# EAGLE design DisplayBoad (EAGLE 6.4)
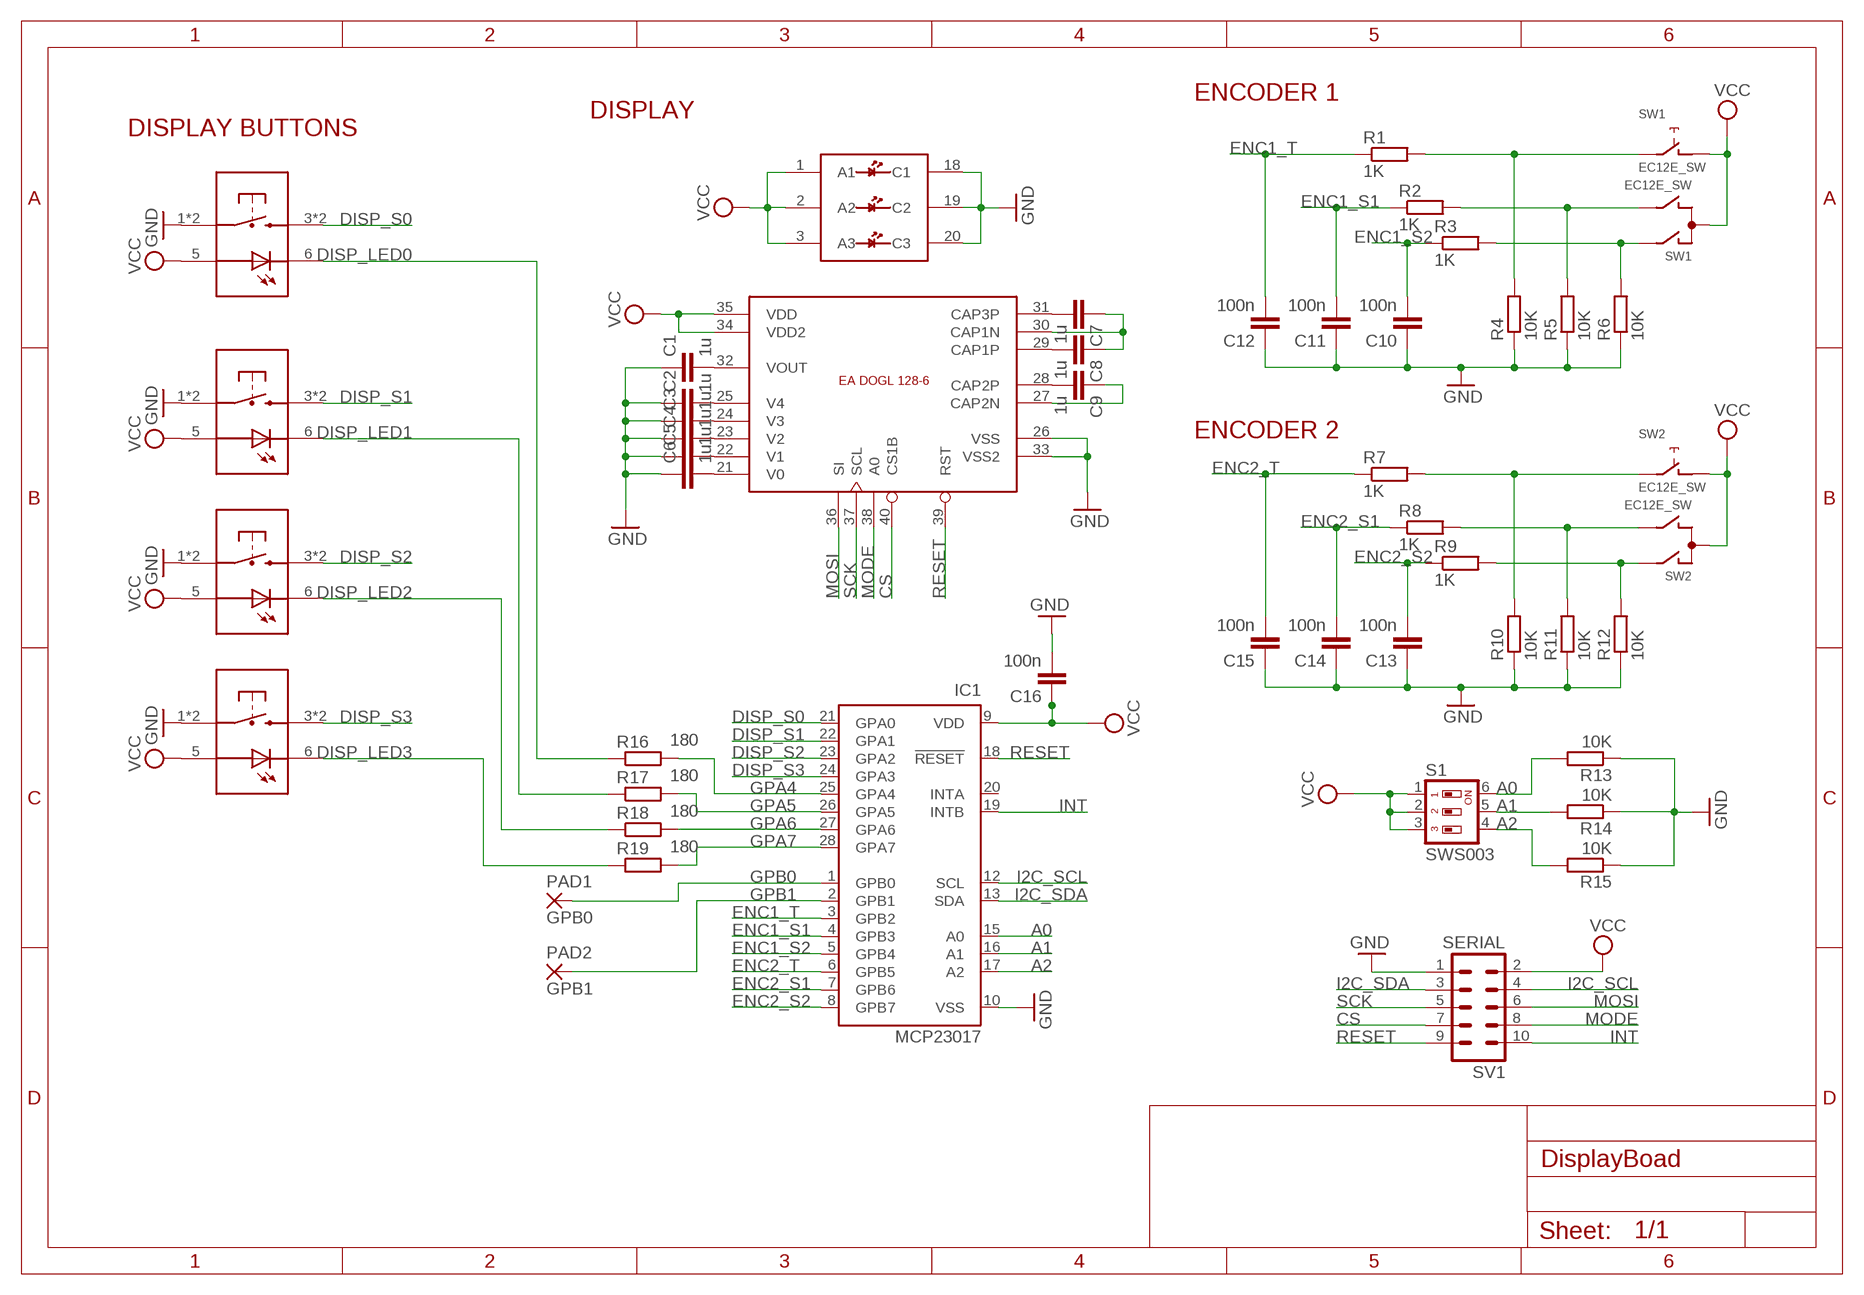
[diagram p0: schematic, sheet 1]

## Parts
C1  1u  C-EUC0805  [C0805]
C2  1u  C-EUC0805  [C0805]
C3  1u  C-EUC0805  [C0805]
C4  1u  C-EUC0805  [C0805]
C5  1u  C-EUC0805  [C0805]
C6  1u  C-EUC0805  [C0805]
C7  1u  C-EUC0805  [C0805]
C8  1u  C-EUC0805  [C0805]
C9  1u  C-EUC0805  [C0805]
C10  100n  C-EUC0603  [C0603]
C11  100n  C-EUC0603  [C0603]
C12  100n  C-EUC0603  [C0603]
C13  100n  C-EUC0603  [C0603]
C14  100n  C-EUC0603  [C0603]
C15  100n  C-EUC0603  [C0603]
C16  100n  C-EUC0603  [C0603]
IC1  MCP23017  MCP23017SS  [SSOP28]
PAD1  GPB0  2,15/1,0  [2,15/1,0]
PAD2  GPB1  2,15/1,0  [2,15/1,0]
R1  1K  R-EU_R0603  [R0603]
R2  1K  R-EU_R0603  [R0603]
R3  1K  R-EU_R0603  [R0603]
R4  10K  R-EU_R0603  [R0603]
R5  10K  R-EU_R0603  [R0603]
R6  10K  R-EU_R0603  [R0603]
R7  1K  R-EU_R0603  [R0603]
R8  1K  R-EU_R0603  [R0603]
R9  1K  R-EU_R0603  [R0603]
R10  10K  R-EU_R0603  [R0603]
R11  10K  R-EU_R0603  [R0603]
R12  10K  R-EU_R0603  [R0603]
R13  10K  R-EU_R0603  [R0603]
R14  10K  R-EU_R0603  [R0603]
R15  10K  R-EU_R0603  [R0603]
R16  180  R-EU_R0603  [R0603]
R17  180  R-EU_R0603  [R0603]
R18  180  R-EU_R0603  [R0603]
R19  180  R-EU_R0603  [R0603]
S1  SWS003  [SMS-003]
SV1  SERIAL  MA05-2  [MA05-2]
SW1  EC12E_SW  [ALPS_EC12E_SW]
SW2  EC12E_SW  [ALPS_EC12E_SW]
U1  EADOGL128-62  [EA_DOGL128-6]
U$2  LP15  [LP15]
U$3  LP15  [LP15]
U$4  LP15  [LP15]
U$5  LP15  [LP15]

## Nets
A0: IC1.15(A0) R13.2 S1.6
A1: IC1.16(A1) R14.2 S1.5
A2: IC1.17(A2) R15.2 S1.4
CS: SV1.7 U1.40(CS1B)
DISP_LED0: R16.1 U$2.6
DISP_LED1: R17.1 U$3.6
DISP_LED2: R18.1 U$4.6
DISP_LED3: R19.1 U$5.6
DISP_S0: IC1.21(GPA0) U$2.3 U$2.4
DISP_S1: IC1.22(GPA1) U$3.3 U$3.4
DISP_S2: IC1.23(GPA2) U$4.3 U$4.4
DISP_S3: IC1.24(GPA3) U$5.3 U$5.4
ENC1_S1: C11.2 IC1.4(GPB3) R2.1
ENC1_S2: C10.2 IC1.5(GPB4) R3.1
ENC1_T: C12.2 IC1.3(GPB2) R1.1
ENC2_S1: C14.2 IC1.7(GPB6) R8.1
ENC2_S2: C13.2 IC1.8(GPB7) R9.1
ENC2_T: C15.2 IC1.6(GPB5) R7.1
GND: C1.1 C2.1 C3.1 C4.1 C5.1 C6.1 C10.1 C11.1 C12.1 C13.1 C14.1 C15.1 C16.2 IC1.10(VSS) R4.1 R5.1 R6.1 R10.1 R11.1 R12.1 R13.1 R14.1 R15.1 SV1.1 U1.18(C1) U1.19(C2) U1.20(C3) U1.26(VSS) U1.33(VSS2) U$2.1 U$2.2 U$3.1 U$3.2 U$4.1 U$4.2 U$5.1 U$5.2
GPA4: IC1.25(GPA4) R16.2
GPA5: IC1.26(GPA5) R17.2
GPA6: IC1.27(GPA6) R18.2
GPA7: IC1.28(GPA7) R19.2
GPB0: IC1.1(GPB0) PAD1.1(P)
GPB1: IC1.2(GPB1) PAD2.1(P)
I2C_SCL: IC1.12(SCL) SV1.4
I2C_SDA: IC1.13(SDA) SV1.3
INT: IC1.19(INTB) SV1.10
MODE: SV1.8 U1.38(A0)
MOSI: SV1.6 U1.36(SI)
N$1: C1.2 U1.32(VOUT)
N$2: C2.2 U1.25(V4)
N$3: C3.2 U1.24(V3)
N$4: C4.2 U1.23(V2)
N$5: C5.2 U1.22(V1)
N$6: C6.2 U1.21(V0)
N$7: C7.2 U1.31(CAP3P)
N$8: C8.2 U1.29(CAP1P)
N$9: C9.2 U1.28(CAP2P)
N$10: C9.1 U1.27(CAP2N)
N$11: C7.1 C8.1 U1.30(CAP1N)
N$12: R7.2 R10.2 SW2.E
N$13: R8.2 R11.2 SW2.B
N$14: R9.2 R12.2 SW2.A
N$15: R1.2 R4.2 SW1.E
N$16: R2.2 R5.2 SW1.B
N$17: R3.2 R6.2 SW1.A
RESET: IC1.18(!RESET) SV1.9 U1.39(RST)
SCK: SV1.5 U1.37(SCL)
VCC: C16.1 IC1.9(VDD) S1.1 S1.2 S1.3 SV1.2 SW1.C SW1.D SW2.C SW2.D U1.1(A1) U1.2(A2) U1.3(A3) U1.34(VDD2) U1.35(VDD) U$2.5 U$3.5 U$4.5 U$5.5
Unconnected: IC1.20(INTA) SW1.GND1(G) SW1.GND2(G) SW2.GND1(G) SW2.GND2(G)

## Notes on the sheet
- ENCODER 1
- DISPLAY
- DISPLAY BUTTONS
- ENCODER 2

## Library data of the parts
C1-C16 = resistor:C-EU: CAPACITOR, European symbol
IC1 = microchip:MCP23017: http://ww1.microchip.com/downloads/en/DeviceDoc/21952a.pdf Source: http://ww1.microchip.com/downloads/en/DeviceDoc/21952a.pdf; MF: MICROCHIP; MPN: MCP23017-E/SS; OC_FARNELL: 1467674; OC_NEWARK: 31K2960
PAD1 PAD2 = wirepad:2,15/1,0: THROUGH-HOLE PAD
R1-R19 = resistor:R-EU_: RESISTOR, European symbol
S1 = smd-special:SWS003: SMD Dip Switch 3 pol.
SV1 = con-lstb:MA05-2: PIN HEADER; OC_FARNELL: unknown; OC_NEWARK: unknown
SW1 SW2 = switch-alps:EC12E_SW: ALPS rotary Encoder EC12E series with switch; MPN: EC12E2424407; OC_FARNELL: 1520813; OC_NEWARK: 74M1068
U1 = ea:EADOGL128-6
U$2-U$5 = SKAARHOJ:LP15

## Board
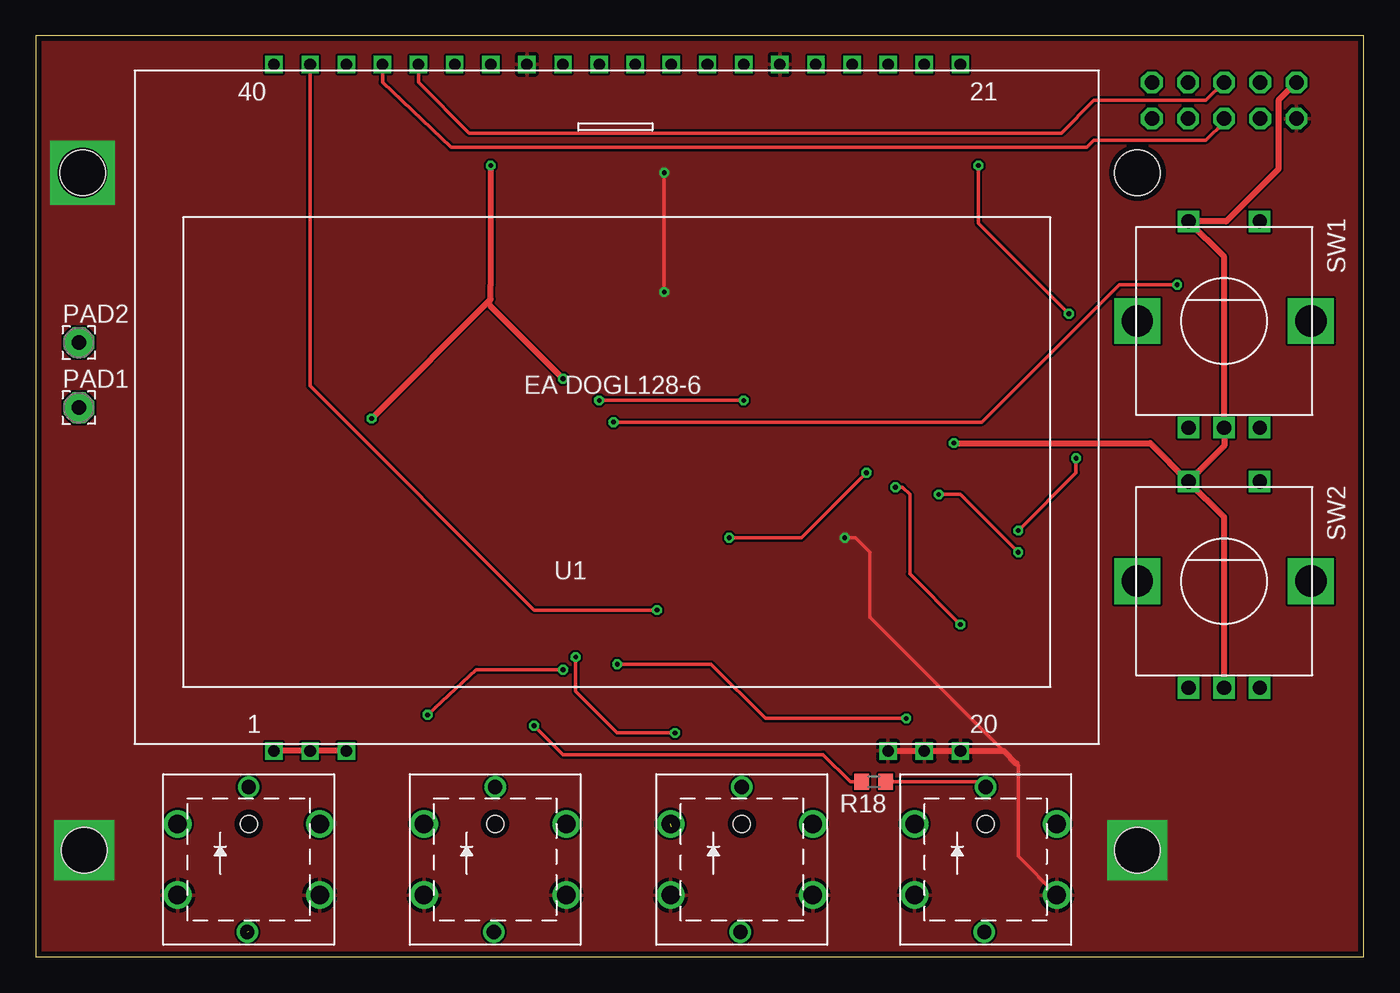
[diagram p1: board, top side]
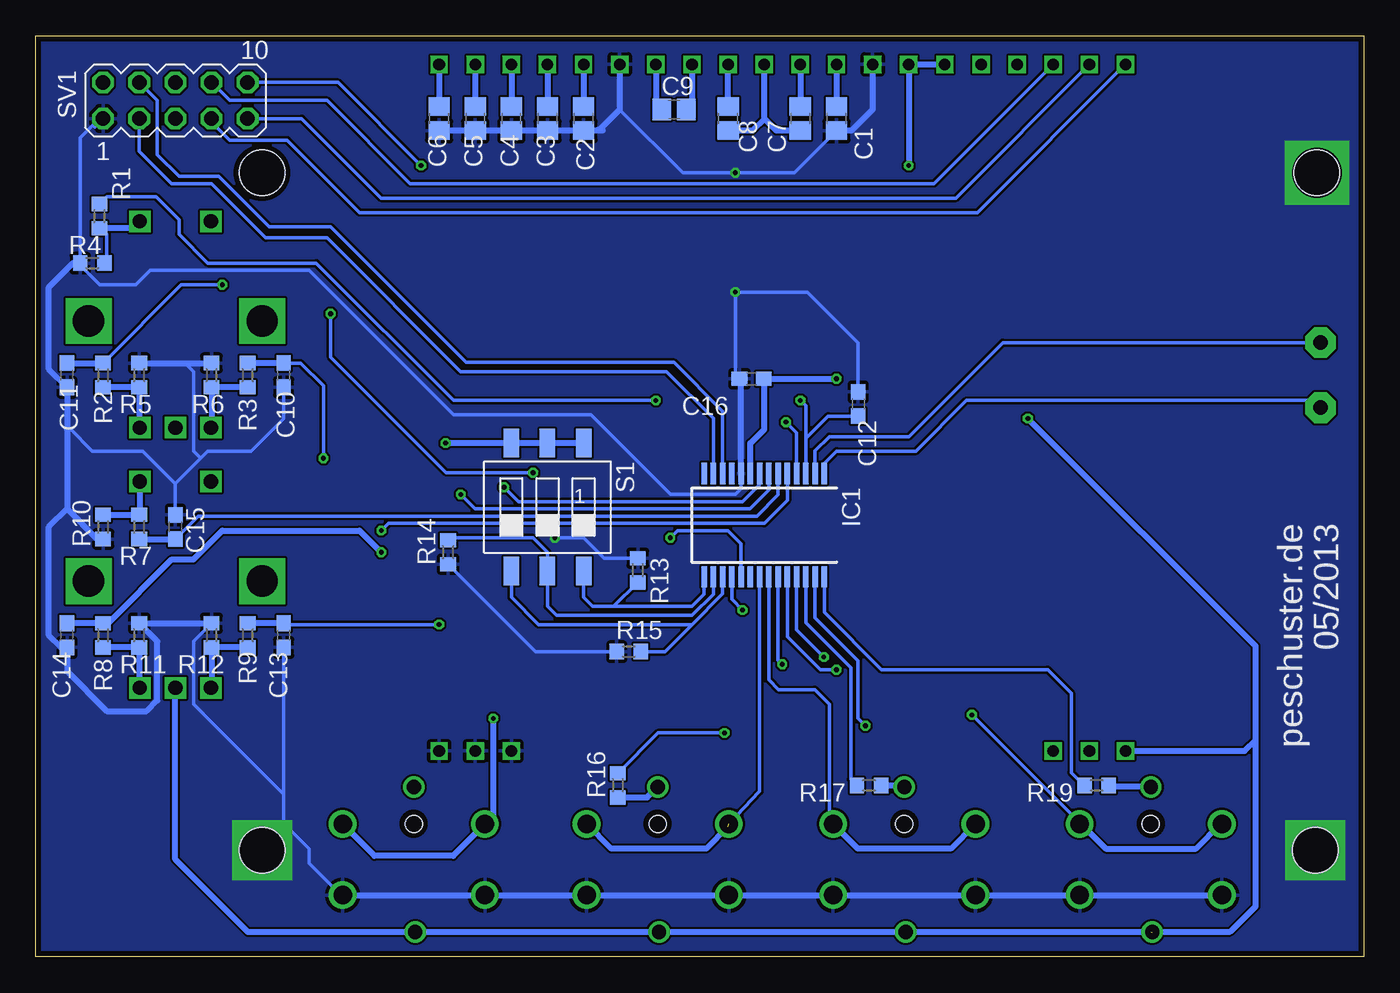
[diagram p2: board, bottom side, seen from below]

Size 93.4 x 64.76 mm. Coordinates in mm from the lower left corner, seen from the top.
Outline: 0,0 93.4,0 93.4,64.76 0,64.76 0,0
Copper layers (1*16): Top 0.0356mm / dielectric 1.5011mm / Bottom 0.0356mm
Design rules "OshPark_PCBOrder": minimum track width 6mil, minimum drill 13mil, track to track 6mil, track to pad 6mil, pad to pad 6mil, via to via 6mil, smd to smd 6mil, copper to edge 15mil, drill to drill 6mil, minimum pad ring 7mil, minimum via ring 7mil, stop-mask expansion 4mil, vias tented up to drill 0mil, thermal gap 10mil
Holes 3.2 mm at 3.43,7.49 77.47,55.12 77.47,7.49 3.3,55.12

### Footprints (pad centres in the part's own frame; a part is rotated, then mirrored left to right if it is on the bottom)
C0805 = smd 1.3 x 1.5: 1 -0.85,0; 2 0.85,0
C0603 = smd 1.1 x 1: 1 -0.85,0; 2 0.85,0
SSOP28 = smd 0.4 x 1.5: 1 -4.225,-3.625; 2 -3.575,-3.625; 3 -2.925,-3.625; 4 -2.275,-3.625; 5 -1.625,-3.625; 6 -0.975,-3.625; 7 -0.325,-3.625; 8 0.325,-3.625; 9 0.975,-3.625; 10 1.625,-3.625; 11 2.275,-3.625; 12 2.925,-3.625; 13 3.575,-3.625; 14 4.225,-3.625; 15 4.225,3.625; 16 3.575,3.625; 17 2.925,3.625; 18 2.275,3.625; 19 1.625,3.625; 20 0.975,3.625; 21 0.325,3.625; 22 -0.325,3.625; 23 -0.975,3.625; 24 -1.625,3.625; 25 -2.275,3.625; 26 -2.925,3.625; 27 -3.575,3.625; 28 -4.225,3.625
2,15/1,0 = drill 1.016 pad 2.159 octagon: 1 0,0
R0603 = smd 1 x 1.1: 1 -0.85,0; 2 0.85,0
SMS-003 = smd 1.092 x 2.007: 1 -2.54,-4.496; 2 0,-4.496; 3 2.54,-4.496; 4 2.54,4.496; 5 0,4.496; 6 -2.54,4.496
MA05-2 = drill 1.016 octagon: 1 -5.08,-1.27; 2 -5.08,1.27; 3 -2.54,-1.27; 4 -2.54,1.27; 5 0,-1.27; 6 0,1.27; 7 2.54,-1.27; 8 2.54,1.27; 9 5.08,-1.27; 10 5.08,1.27
ALPS_EC12E_SW = drill 1 square: A -2.5,-7.5; B 2.5,-7.5; C 0,-7.5; D -2.5,7; E 2.5,7 | drill 2.2 square: GND1 -6.1,0; GND2 6.1,0
EA_DOGL128-6 = drill 0.813 square: 1 0,0; 2 2.54,0; 3 5.08,0; 18 43.18,0; 19 45.72,0; 20 48.26,0; 21 48.26,48.26; 22 45.72,48.26; 23 43.18,48.26; 24 40.64,48.26; 25 38.1,48.26; 26 35.56,48.26; 27 33.02,48.26; 28 30.48,48.26; 29 27.94,48.26; 30 25.4,48.26; 31 22.86,48.26; 32 20.32,48.26; 33 17.78,48.26; 34 15.24,48.26; 35 12.7,48.26; 36 10.16,48.26; 37 7.62,48.26; 38 5.08,48.26; 39 2.54,48.26; 40 0,48.26
LP15 = drill 1.3: 1 -5,-2; 2 5,-2; 3 -5,3; 4 5,3 | drill 1: 5 -0.1,-4.6; 6 0,5.6 | hole 1.2: 0,3

### Placement (x,y rotation side)
C1  37.08,58.93 90 bottom
C2  54.86,58.93 90 bottom
C3  57.4,58.93 90 bottom
C4  59.94,58.93 90 bottom
C5  62.48,58.93 90 bottom
C6  65.02,58.93 90 bottom
C7  39.62,58.93 90 bottom
C8  44.7,58.93 90 bottom
C9  48.51,59.56 0 bottom
C10  75.95,40.89 90 bottom
C11  91.19,40.89 90 bottom
C12  35.56,38.86 270 bottom
C13  75.95,22.61 90 bottom
C14  91.19,22.61 90 bottom
C15  83.57,30.23 270 bottom
C16  43.05,40.64 180 bottom
IC1  42.16,30.35 180 bottom
PAD1  3.05,38.61 0 top
PAD2  3.05,43.18 0 top
R1  88.9,52.07 270 bottom
R2  88.65,40.89 270 bottom
R3  78.49,40.89 270 bottom
R4  89.41,48.77 0 bottom
R5  86.11,40.89 270 bottom
R6  81.03,40.89 270 bottom
R7  86.11,30.23 90 bottom
R8  88.65,22.61 270 bottom
R9  78.49,22.61 270 bottom
R10  88.65,30.23 90 bottom
R11  86.11,22.61 270 bottom
R12  81.03,22.61 270 bottom
R13  51.05,27.18 270 bottom
R14  64.39,28.45 90 bottom
R15  51.69,21.46 0 bottom
R16  52.45,12.06 90 bottom
R17  34.8,12.06 180 bottom
R18  58.93,12.32 180 top
R19  18.8,12.06 180 bottom
S1  57.4,31.62 180 bottom
SV1  83.57,60.2 0 bottom
SW1  83.57,44.7 0 top
SW2  83.57,26.42 0 top
U1  16.76,14.48 0 top
U$2  49.66,6.35 0 top
U$3  32.32,6.35 0 top
U$4  66.8,6.35 0 top
U$5  14.99,6.35 0 top

### Tracks (layer width: path | path; a pad name or v marks a point on that pad's centre or on a via)
A0
  Bottom 0.254: IC1.15 46.39,25.49 47.24,24.64 52.74,24.64 | S1.6 54.86,25.27 54.23,24.64 52.74,24.64 | 52.74,24.64 R13.2
A1
  Bottom 0.254: IC1.16 45.74,25.51 47.24,24 56.77,24 57.4,24.64 S1.5 57.4,28.45 58.42,29.46 64.22,29.46 R14.2
A2
  Bottom 0.254: IC1.17 45.09,25.52 47.24,23.37 | 47.24,23.37 58.04,23.37 59.94,25.27 S1.4 | R15.2 49.15,21.46 47.24,23.37
CS
  Bottom 0.254: U1.40 27.18,52.32 70.61,52.32 75.69,57.4 79.76,57.4 81.03,58.67 SV1.7
DISP_LED0
  Bottom 0.406: R16.1 50.39,11.21 U$2.6
DISP_LED1
  Bottom 0.406: R17.1 32.51,12.06 U$3.6
DISP_LED2
  Top 0.254: U$4.6 66.41,12.32 R18.1
DISP_LED3
  Bottom 0.406: U$5.6 17.95,11.95 R19.1
DISP_S0  (1 unrouted)
  Bottom 0.254: IC1.21 42.49,11.64 U$2.3
  Bottom 0.406: 44.7,9.14 46.23,7.62 52.93,7.62 U$2.4
DISP_S1
  Bottom 0.254: IC1.22 41.84,19.49 41.15,18.8 38.61,18.8 37.59,17.78 37.59,9.94 U$3.4
  Bottom 0.406: 37.34,9.4 U$3.4 35.59,7.62 29.05,7.62 U$3.3
DISP_S2  (via drill 0.33)
  Top 0.254: v40.89,20.57 47.5,20.57 51.31,16.76 v61.21,16.76
  Bottom 0.254: IC1.23 41.19,20.87 v40.89,20.57 | 61.21,9.68 U$4.3
  Bottom 0.406: v61.21,16.76 61.21,9.68 | U$4.3 64.04,7.11 69.56,7.11 U$4.4
DISP_S3  (via drill 0.33)
  Top 0.254: v27.56,17.02 30.99,20.19 v37.08,20.19
  Bottom 0.254: 20.07,9.53 v27.56,17.02 | IC1.24 40.54,22.5 38.23,20.19 v37.08,20.19
  Bottom 0.406: U$5.4 20.07,9.53 18.16,7.62 11.81,7.62 10.08,9.35 U$5.3
ENC1_S1  (via drill 0.33)
  Top 0.254: v40.64,37.59 66.55,37.59 76.2,47.24 v80.26,47.24
  Bottom 0.254: IC1.4 39.89,36.84 v40.64,37.59 | v80.26,47.24 83.15,47.24 R2.1
  Bottom 0.406: C11.2 R2.1
ENC1_S2  (via drill 0.33)
  Top 0.254: v69.09,29.97 73.15,34.04 v73.15,35.05
  Bottom 0.254: IC1.5 40.54,32.1 42.16,30.48 68.58,30.48 v69.09,29.97 | v73.15,35.05 73.15,40.13 74.76,41.74 C10.2
  Bottom 0.406: C10.2 R3.1
ENC1_T  (via drill 0.33)
  Top 0.254: v49.78,39.12 v39.62,39.12
  Bottom 0.254: 88.81,52.92 R1.1 88.39,53.43 84.92,53.43 83.31,51.82 83.31,50.8 81.28,48.77 73.66,48.77 64.01,39.12 v49.78,39.12 | v39.62,39.12 39.24,38.73 39.24,36.45 | IC1.3 39.24,36.45 | 39.24,36.45 37.68,38.01 C12.2
ENC2_S1  (via drill 0.33)
  Top 0.254: v69.09,28.45 65.02,32.51 v63.5,32.51
  Bottom 0.254: IC1.7 41.84,32.84 43.18,31.5 62.48,31.5 v63.5,32.51
  Bottom 0.406: C14.2 R8.1 88.3,23.46 83.82,27.94 82.3,27.94 80.26,29.97 70.61,29.97 v69.09,28.45
ENC2_S2  (via drill 0.33)
  Top 0.254: v60.45,33.02 60.96,33.02 61.47,32.51 61.47,26.92 v65.02,23.37
  Bottom 0.254: IC1.8 42.49,33.2 43.69,32 59.44,32 v60.45,33.02 | v65.02,23.37 75.86,23.37 C13.2
  Bottom 0.406: C13.2 R9.1
ENC2_T
  Bottom 0.254: IC1.6 41.19,32.47 42.67,30.99 81.95,30.99 C15.2
  Bottom 0.406: R7.1 C15.2
GND  (via drill 0.33, 3.2, 3.5)
  Top 0.254: v56.9,29.46 57.66,29.46 58.67,28.45 58.67,23.88 68.96,13.59 69.09,13.46 69.09,7.06 U$4.2 | v44.2,55.12 v44.2,46.74
  Top 0.406: U1.18 U1.19 U1.20 68.07,14.48 68.96,13.59
  Bottom 0.254: R15.1 58.25,21.46 R14.1 | R13.1 53.43,28.03 54.86,29.46 v56.9,29.46 | 52.32,59.56 47.88,55.12 v44.2,55.12 40.04,55.12 C1.1 | C16.2 44.2,40.93 v44.2,46.74 39.12,46.74 35.56,43.18 C12.1 | C10.1 75.95,37.85 78.23,35.56 81.28,35.56 81.79,35.05 | 81.79,35.05 83.57,33.27 | 83.57,33.27 C15.1 | R5.1 82.89,41.74 82.3,41.15 82.3,35.56 81.79,35.05 | 83.57,33.27 85.85,35.56 89.41,35.56 90.93,37.08 91.19,37.08 | C13.1 75.95,11.43 | 75.95,11.43 75.95,9 75.44,8.89 74.17,7.62 74.17,6.6 71.91,4.35 U$4.2 | R12.1 82.3,22.19 82.3,17.78 75.95,11.43 | SV1.1 89.24,58.33 89.24,58.59 | IC1.10 43.79,32.92 44.2,32.51 48.77,32.51 54.36,38.1 64.01,38.1 74.17,48.26 85.34,48.26 86.36,47.24 88.9,47.24 90.26,48.6 | R4.1 90.26,57.57 89.24,58.59 | 89.24,58.59 88.9,58.93
  Bottom 0.406: U$4.2 U$4.1 U$2.2 U$2.1 U$3.2 U$3.1 U$5.2 U$5.1 | R12.1 R11.1 84.84,22.19 84.84,18.03 85.6,17.27 88.39,17.27 91.19,20.07 C14.1 91.61,21.76 92.46,22.61 92.46,30.23 91.19,31.5 | 91.19,31.5 91.19,37.08 C11.1 92.46,41.31 92.46,47.08 90.77,48.77 R4.1 | 91.19,31.5 89.07,29.38 R10.1 | R5.1 R6.1 | U1.26 52.32,59.56 53.81,58.08 | 53.81,58.08 C2.1 | C2.1 C3.1 C4.1 C5.1 C6.1 | U1.33 34.54,59.56 36.03,58.08 C1.1 | 53.81,58.08 53.85,58.17 | IC1.10 43.79,40.53 C16.2 | 53.51,58.08 C2.1
  other vias: 3.3,55.12 3.43,7.49 77.47,7.49
  pour Bottom: -1.02,64.52 95,64.52 95,-0.51 -1.02,-0.51
  pour Top: -0.51,65.02 94.49,65.02 94.49,-0.51 -0.51,-0.51
GPA4  (via drill 0.33)
  Top 0.254: v37.97,21.08 37.97,18.67 40.89,15.75 v44.96,15.75
  Bottom 0.254: IC1.25 39.89,23 v37.97,21.08 | v44.96,15.75 49.62,15.75 R16.2
GPA5
  Bottom 0.254: IC1.26 39.24,23.49 36.07,20.32 36.07,12.48 R17.2
GPA6  (via drill 0.33)
  Top 0.254: v35.05,16.26 37.08,14.22 55.37,14.22 57.28,12.32 R18.2
  Bottom 0.254: IC1.27 38.59,23.86 35.56,20.83 35.56,16.76 v35.05,16.26
GPA7
  Bottom 0.254: IC1.28 37.94,24.22 33.91,20.19 22.23,20.19 20.57,18.54 20.57,12.95 19.81,12.19 19.65,12.28 R19.2
GPB0
  Bottom 0.254: IC1.1 37.94,34.7 37.08,35.56 31.5,35.56 27.94,39.12 3.56,39.12 PAD1.1
GPB1
  Bottom 0.254: IC1.2 38.59,35.58 37.59,36.58 32,36.58 25.4,43.18 PAD2.1
I2C_SCL
  Bottom 0.254: IC1.12 45.09,38.36 48.51,41.78 63.12,41.78 72.64,51.31 76.96,51.31 80.52,54.86 83.31,54.86 84.84,56.39 84.84,60.2 SV1.4
I2C_SDA
  Bottom 0.254: IC1.13 45.74,37.87 49.02,41.15 63.5,41.15 72.9,50.55 77.22,50.55 81.03,54.36 83.82,54.36 86.11,56.64 SV1.3
INT  (via drill 0.33)
  Top 0.254: v48.77,29.46 53.85,29.46 v58.42,34.04 | v72.64,45.21 66.29,51.56 v66.29,55.63
  Bottom 0.254: IC1.19 43.79,29.06 44.7,29.97 48.26,29.97 v48.77,29.46 | v58.42,34.04 64.52,34.04 72.64,42.16 v72.64,45.21 | v66.29,55.63 72.14,61.47 SV1.10
MODE
  Bottom 0.254: U1.38 30.23,54.36 67.06,54.36 72.9,60.2 79.76,60.2 SV1.8
MOSI
  Top 0.254: SV1.6 82.3,60.2 74.42,60.2 72.14,57.91 30.48,57.91 26.92,61.47 U1.36
N$1
  Bottom 0.406: U1.32 C1.2
N$2
  Bottom 0.406: U1.25 C2.2
N$3
  Bottom 0.406: U1.24 C3.2
N$4
  Bottom 0.406: U1.23 C4.2
N$5
  Bottom 0.406: U1.22 C5.2
N$6
  Bottom 0.406: U1.21 C6.2
N$7
  Bottom 0.406: U1.31 C7.2
N$8
  Bottom 0.406: C8.2 U1.29
N$9
  Bottom 0.406: U1.28 47.24,59.98 C9.2
N$10
  Bottom 0.406: U1.27 49.78,59.98 C9.1
N$11
  Bottom 0.406: C7.1 41.31,58.08 42.16,58.93 | 42.16,58.93 U1.30 | 42.16,58.93 43.01,58.08 C8.1
N$12
  Bottom 0.406: SW2.E 86.07,31.12 R7.2 R10.2
N$13
  Bottom 0.406: SW2.B 86.07,21.72 R11.2 R8.2
N$14
  Bottom 0.406: SW2.A 81.03,18.96 R12.2 R9.2
N$15
  Bottom 0.254: R1.2 88.9,51.31 88.39,50.8 88.39,48.93 R4.2
  Bottom 0.406: SW1.E 86.55,51.22 R1.2
N$16
  Bottom 0.406: SW1.B 86.07,40 R5.2 R2.2
N$17
  Bottom 0.406: SW1.A 81.03,37.24 R6.2 R3.2
RESET  (via drill 0.33)
  Top 0.254: v43.69,24.38 35.05,24.38 19.3,40.13 U1.39
  Bottom 0.254: IC1.18 44.44,25.14 v43.69,24.38 | SV1.9 74.68,58.93 69.09,53.34 28.7,53.34 U1.39
SCK
  Top 0.254: U1.37 24.38,61.47 29.21,56.9 73.91,56.9 74.42,57.4 82.3,57.4 83.57,58.67 SV1.5
VCC  (via drill 0.33)  (1 unrouted)
  Top 0.254: 32,47.24 32,45.72
  Top 0.406: SW2.C 83.57,30.92 SW2.D | v37.08,40.64 32,45.72 | v32,55.63 32,47.24 32,46.23 v23.62,37.85 | SV1.2 87.38,60.2 87.38,55.37 83.71,51.7 SW1.D 83.57,49.2 SW1.C 83.57,35.92 SW2.D | v64.57,36.12 78.36,36.12 SW2.D | U1.3 U1.2 U1.1
  Bottom 0.254: 42.16,40.6 C16.1
  Bottom 0.406: U$5.5 U$3.5 U$2.5 U$4.5 78.46,1.75 83.57,6.86 SW2.C | U1.35 U1.34 v32,55.63 | S1.1 S1.2 S1.3 v64.57,36.12 | IC1.9 43.14,36.11 42.16,37.08 42.16,40.6 | C16.1 v37.08,40.64 | 14.99,1.78 9.4,1.78 7.62,3.56 7.62,15.24 | 7.62,15.24 7.62,21.84 v23.62,37.85 | U1.1 8.38,14.48 7.62,15.24

### Text on the board
bNames: 05/2013 | peschuster.de